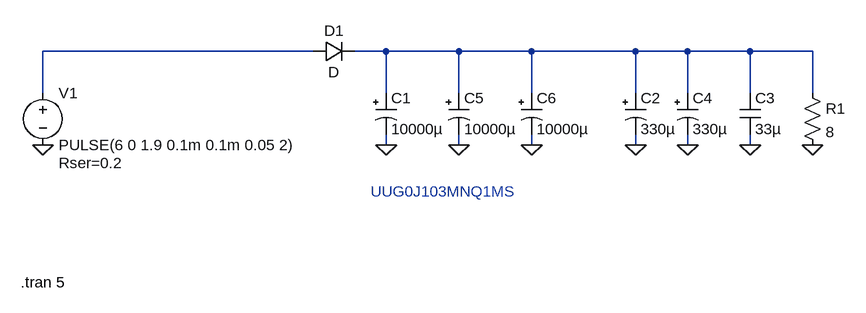
[diagram p0: schematic Spannungsdrop.asc]
Spannungsdrop.asc, the LTspice schematic file:
Version 4
SHEET 1 1160 680
WIRE 336 48 -80 48
WIRE 448 48 400 48
WIRE 560 48 448 48
WIRE 672 48 560 48
WIRE 832 48 672 48
WIRE 912 48 832 48
WIRE 1008 48 912 48
WIRE 1104 48 1008 48
WIRE -80 112 -80 48
WIRE 448 112 448 48
WIRE 560 112 560 48
WIRE 672 112 672 48
WIRE 832 112 832 48
WIRE 912 112 912 48
WIRE 1008 112 1008 48
WIRE 1104 112 1104 48
WIRE 448 192 448 176
WIRE 560 192 560 176
WIRE 672 192 672 176
WIRE 832 192 832 176
WIRE 912 192 912 176
WIRE 1008 192 1008 176
FLAG 1104 192 0
FLAG 448 192 0
FLAG -80 192 0
FLAG 832 192 0
FLAG 1008 192 0
FLAG 912 192 0
FLAG 560 192 0
FLAG 672 192 0
SYMBOL polcap 432 112 R0
WINDOW 3 24 56 Left 2
SYMATTR InstName C1
SYMATTR Value 10000µ
SYMATTR Description Capacitor
SYMATTR Type cap
SYMATTR SpiceLine V=6.3 Irms=2.75 Rser=0.02 Lser=0 mfg="Nichicon" pn="UPL0J103MRH" type="Al electrolytic"
SYMBOL res 1088 96 R0
SYMATTR InstName R1
SYMATTR Value 8
SYMBOL voltage -80 96 R0
WINDOW 123 0 0 Left 2
WINDOW 39 24 124 Left 2
SYMATTR InstName V1
SYMATTR Value PULSE(6 0 1.9 0.1m 0.1m 0.05 2)
SYMATTR SpiceLine Rser=0.2
SYMBOL diode 336 64 R270
WINDOW 0 32 32 VTop 2
WINDOW 3 0 32 VBottom 2
SYMATTR InstName D1
SYMBOL polcap 816 112 R0
WINDOW 3 24 56 Left 2
SYMATTR InstName C2
SYMATTR Value 330µ
SYMATTR Description Capacitor
SYMATTR Type cap
SYMATTR SpiceLine V=2.5 Irms=3.87298 Rser=0.015 Lser=0 mfg="KEMET" pn="A700X337M2R5ATE015" type="Al electrolytic"
SYMBOL cap 992 112 R0
SYMATTR InstName C3
SYMATTR Value 33µ
SYMATTR SpiceLine V=6.3 Irms=15.2 Rser=0.00332739 Lser=0 mfg="KEMET" pn="C1210C336K9RAC" type="X7R"
SYMBOL polcap 896 112 R0
WINDOW 3 24 56 Left 2
SYMATTR InstName C4
SYMATTR Value 330µ
SYMATTR Description Capacitor
SYMATTR Type cap
SYMATTR SpiceLine V=2.5 Irms=3.87298 Rser=0.015 Lser=0 mfg="KEMET" pn="A700X337M2R5ATE015" type="Al electrolytic"
SYMBOL polcap 544 112 R0
WINDOW 3 24 56 Left 2
SYMATTR InstName C5
SYMATTR Value 10000µ
SYMATTR Description Capacitor
SYMATTR Type cap
SYMATTR SpiceLine V=6.3 Irms=2.75 Rser=0.02 Lser=0 mfg="Nichicon" pn="UPL0J103MRH" type="Al electrolytic"
SYMBOL polcap 656 112 R0
WINDOW 3 24 56 Left 2
SYMATTR InstName C6
SYMATTR Value 10000µ
SYMATTR Description Capacitor
SYMATTR Type cap
SYMATTR SpiceLine V=6.3 Irms=2.75 Rser=0.02 Lser=0 mfg="Nichicon" pn="UPL0J103MRH" type="Al electrolytic"
TEXT -114 404 Left 2 !.tran 5
TEXT 424 264 Left 2 ;UUG0J103MNQ1MS

The netlist it stands for:
* Spannungsdrop.asc
C1 N002 0 10000µ V=6.3 Irms=2.75 Rser=0.02 Lser=0 mfg="Nichicon" pn="UPL0J103MRH" type="Al electrolytic"
R1 N002 0 8
V1 N001 0 PULSE(6 0 1.9 0.1m 0.1m 0.05 2) Rser=0.2
D1 N001 N002 D
C2 N002 0 330µ V=2.5 Irms=3.87298 Rser=0.015 Lser=0 mfg="KEMET" pn="A700X337M2R5ATE015" type="Al electrolytic"
C3 N002 0 33µ V=6.3 Irms=15.2 Rser=0.00332739 Lser=0 mfg="KEMET" pn="C1210C336K9RAC" type="X7R"
C4 N002 0 330µ V=2.5 Irms=3.87298 Rser=0.015 Lser=0 mfg="KEMET" pn="A700X337M2R5ATE015" type="Al electrolytic"
C5 N002 0 10000µ V=6.3 Irms=2.75 Rser=0.02 Lser=0 mfg="Nichicon" pn="UPL0J103MRH" type="Al electrolytic"
C6 N002 0 10000µ V=6.3 Irms=2.75 Rser=0.02 Lser=0 mfg="Nichicon" pn="UPL0J103MRH" type="Al electrolytic"
.model D D
.lib standard.dio
.tran 5
* UUG0J103MNQ1MS
.backanno
.end